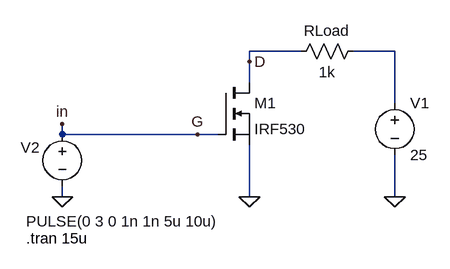
[diagram p0: schematic lab_04_LSSchalter_ohneTreiber_Loesung.asc]
lab_04_LSSchalter_ohneTreiber_Loesung.asc, the LTspice schematic file:
Version 4
SHEET 1 880 680
WIRE 320 16 240 16
WIRE 464 16 400 16
WIRE 240 32 240 16
WIRE 240 64 240 32
WIRE 464 96 464 16
WIRE -48 144 -48 128
WIRE 160 144 -48 144
WIRE 192 144 160 144
WIRE -48 240 -48 224
WIRE 240 240 240 160
WIRE 464 240 464 176
FLAG 240 240 0
FLAG -48 240 0
FLAG 464 240 0
FLAG 160 144 G
FLAG 240 32 D
FLAG -48 128 in
SYMBOL nmos 192 64 R0
SYMATTR InstName M1
SYMATTR Value IRF530
SYMBOL voltage 464 80 R0
SYMATTR InstName V1
SYMATTR Value 25
SYMBOL voltage -48 128 R0
WINDOW 123 0 0 Left 0
WINDOW 39 0 0 Left 0
WINDOW 0 -64 36 Left 2
WINDOW 3 -56 150 Left 2
SYMATTR InstName V2
SYMATTR Value PULSE(0 3 0 1n 1n 5u 10u)
SYMBOL res 416 0 R90
WINDOW 0 0 56 VBottom 2
WINDOW 3 32 56 VTop 2
SYMATTR InstName RLoad
SYMATTR Value 1k
TEXT -104 304 Left 2 !.tran 15u

The netlist it stands for:
* lab_04_LSSchalter_ohneTreiber_Loesung.asc
M1 D in 0 0 IRF530
V1 N001 0 25
V2 in 0 PULSE(0 3 0 1n 1n 5u 10u)
RLoad N001 D 1k
.model NMOS NMOS
.model PMOS PMOS
.lib standard.mos
.tran 15u
.backanno
.end